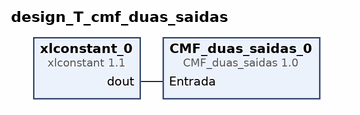
[diagram p0: block diagram of the top level]
# Vivado block design design_T_cmf_duas_saidas, xc7z020clg484-1, Vivado 2018.3
create_bd_design design_T_cmf_duas_saidas

create_bd_cell -type ip -vlnv xilinx.com:user:CMF_duas_saidas:1.0 CMF_duas_saidas_0
create_bd_cell -type ip -vlnv xilinx.com:ip:xlconstant:1.1 xlconstant_0
set_property -dict {CONFIG.CONST_VAL 7 CONFIG.CONST_WIDTH 32} [get_bd_cells xlconstant_0]

# ---- connections ----

connect_bd_net [get_bd_pins xlconstant_0/dout] [get_bd_pins CMF_duas_saidas_0/Entrada]

validate_bd_design
save_bd_design
